# Altium schematic sheet PyroDriver.SchDoc: 12V Low Side Solenoid Switch
size A; ApprovedBy: PRELIM RELEASE; DrawnBy: J. Sullivan; Organization: ORGANIZATION; Address1: ADDRESS 1; Address2: ADDRESS 2; Address3: ADDRESS 3; Address4: ADDRESS 4; Revision: -; SheetNumber: 12; SheetTotal: 13; ENG_APP_DATE: 2/22/22; DSN_APP_DATE: --/--/--; CHK_APP_DATE: --/--/--
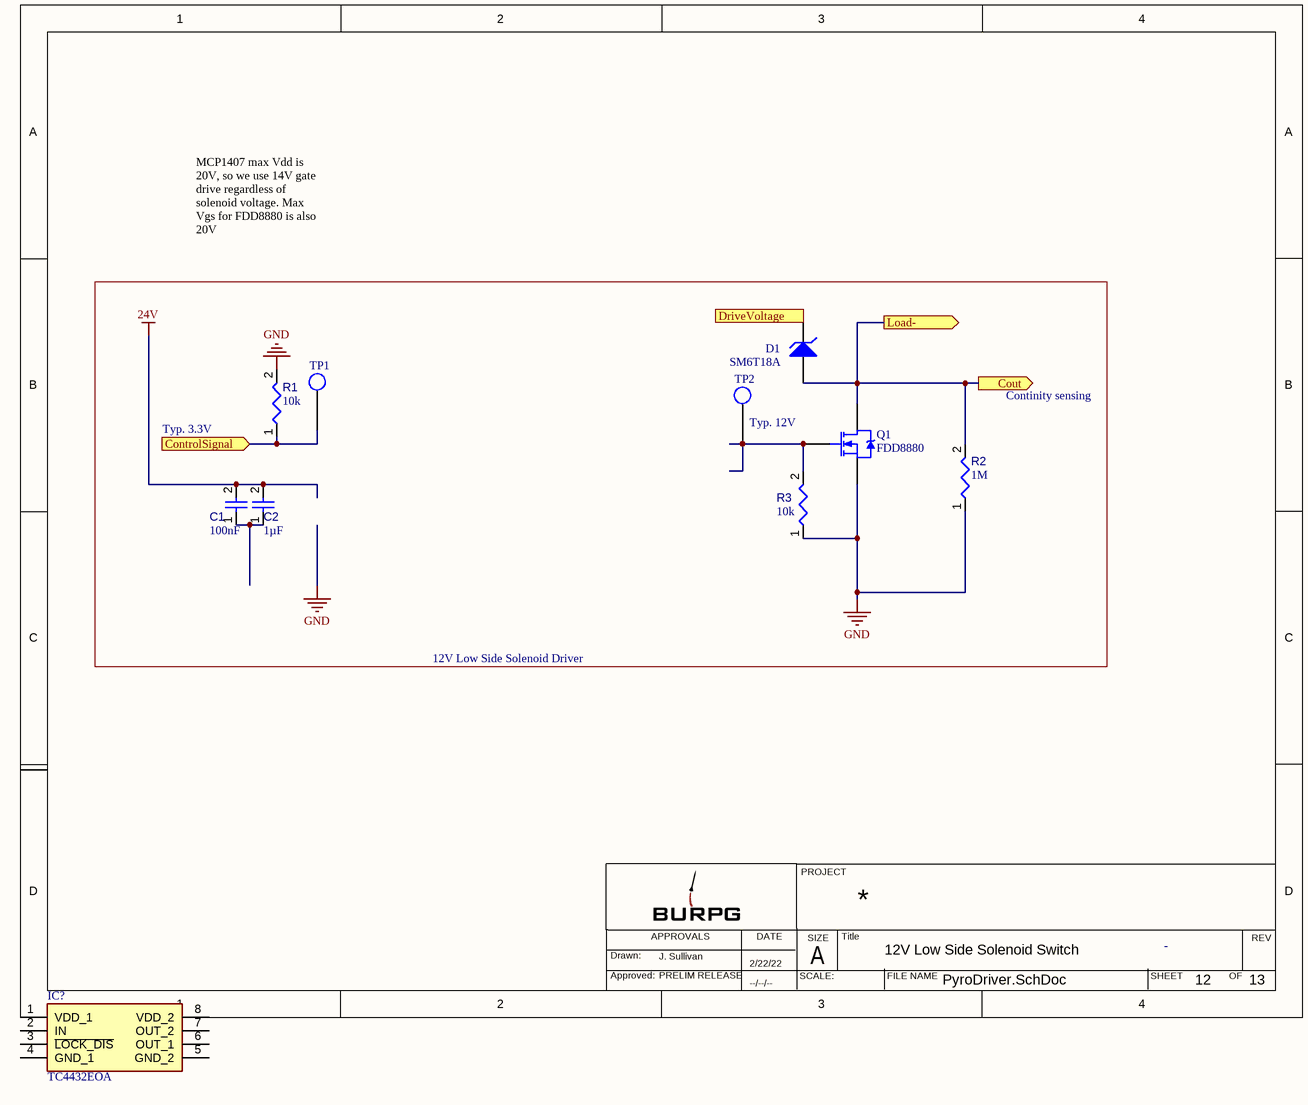
[diagram p0: PyroDriver.SchDoc]

## Parts
C1  value 100nF  [CAPC2013X95X50LL10T25]  (hidden comment: Capacitor 100 nF +/-10% 50 V 0805)
C2  value 1µF  [CAPC2013X135X45NL10T25]  (hidden comment: Capacitor 1 uF +/- 10% 50 V 0805)
D1  SM6T18A  [SMB]
IC?  TC4432EOA  [SOIC127P600X175-8N]
Q1  FDD8880  [DPAK/TO-252 3 LD ONSEMI]
R1  value 10k  [RESC2013X50X35ML15T15]  (hidden comment: Resistor 10k +/-1% 0805 125 mW)
R2  value 1M  [RESC0402(1005)_L]  (hidden comment: 1MR2J)
R3  value 10k  [RESC2013X50X35ML15T15]  (hidden comment: RES-2)
TP1  BURPG_TestPoint1  [BURPG_TestPoint1]  (value not drawn)  (no BOM)
TP2  BURPG_TestPoint1  [BURPG_TestPoint1]  (value not drawn)  (no BOM)

## Ports
ControlSignal (in), Cout (out), DriveVoltage (in), Load- (out)

## Nets
24V: C1.2 C2.2
GND: Q1.3(S) R1.2 R2.1 R3.1
ControlSignal: R1.1 TP1.1 ; port ControlSignal
Cout: D1.1(A) Q1.2(D) R2.2 ; port Load-, port Cout
DriveVoltage: D1.2(K) ; port DriveVoltage
NetC1_1: C1.1 C2.1
NetQ1_1: Q1.1(G) R3.2 TP2.1

Not connected (* = marked no-connect by the designer): IC? 1(VDD_1) 2(IN) 3(~{LOCK_DIS}) 4(GND_1) 5(GND_2) 6(OUT_1) 7(OUT_2) 8(VDD_2)

## Notes on the sheet
- MCP1407 max Vdd is 20V, so we use 14V gate drive regardless of solenoid voltage. Max Vgs for FDD8880 is also 20V
- Typ. 3.3V
- (near TP2) Typ. 12V
- Continity sensing
- 12V Low Side Solenoid Driver
- PROJECT
- Drawn:
- Approved:
- APPROVALS
- DATE
- SCALE:
- SIZE
- A
- Title
- FILE NAME
- SHEET
- OF
- REV

## Library data of the parts
C1 = CMP-001-00018-6: Chip Capacitor, 100 nF, +/- 10%, 50 V, 0805 (2012 Metric); Capacitor Type: Ceramic; Voltage Rating: 50V; Case/Package: 0805; Max Operating Temperature: 125°C; Min Operating Temperature: -55°C; Mounting Technology: SM; Pins: 2; RoHS Compliant: True; Tolerance: 10%
C2 = CMP-001-00007-6: Chip Capacitor, 1 uF, +/- 10%, 50 V, 0805 (2012 Metric); Capacitor Type: Ceramic; Voltage Rating: 50V; Case/Package: 0805; Max Operating Temperature: 125°C; Min Operating Temperature: -55°C; Mounting Technology: SM; Pins: 2; RoHS Compliant: True; Tolerance: 10%
D1 = D Zener: Zener Diode; Published: 8-Jun-2000; LatestRevisionDate: 17-Jul-2002; LatestRevisionNote: Re-released for DXP Platform.; PackageReference: SMB; Publisher: Altium Limited; PackageDescription: SMB
IC? = TC4432EOA: Integrated Circuit; Manufacturer_Name: Microchip; Datasheet Link: https://datasheet.datasheetarchive.com/originals/distributors/Datasheets-306/110014.pdf; Height: 1.75mm; Manufacturer_Part_Number: TC4432EOA; Mouser Part Number: 579-TC4432EOA; Mouser Price/Stock: https://www.mouser.co.uk/ProductDetail/Microchip-Technology-Atmel/TC4432EOA?qs=z30FE1aq6wa0FDI34oT9zw%3D%3D; Arrow Part Number: TC4432EOA; Arrow Price/Stock: https://www.arrow.com/en/products/tc4432eoa/microchip-technology?region=nac
Q1 = BURPG_NMOS_FDD8880: onsemi / Fairchild MOSFET 30V N-Channel PowerTrench; Note: Pin 2 is electrically connected to pin 4.; Published: 8-Jun-2000; LatestRevisionDate: 17-Jul-2002; LatestRevisionNote: Re-released for DXP Platform.; DatasheetVersion: PD-9.814; PackageVersion: Feb-1997; PackageReference: TO-220AB; Publisher: Altium Limited; PackageDescription: TO, Thru-Hole, Vertical, Heatsink Mounted; 3 In-Line Leads; Pitch 2.54 mm; ComponentLink1Description: Manufacturer Link; ComponentLink1URL: http://www.irf.com/
R1 R3 = CMP-009-00018-5: Chip Resistor, 10 KOhm, +/- 1%, 125 mW, -55 to 155 degC, 0805 (2012 Metric); Power: 125mW; Voltage Rating: 150V; Tolerance: 1%; Pins: 2; Min Operating Temperature: -55°C; Case/Package: 0805; Max Operating Temperature: 155°C; RoHS Compliant: True; Mounting Technology: SM
R2 = CMP-009-00077-2: 1M 0.063W 5% 0402 (1005 Metric)  SMD; Power: 63mW; Tolerance: 5%; Case/Package: 0402; Pins: 2; Mounting Technology: SMT